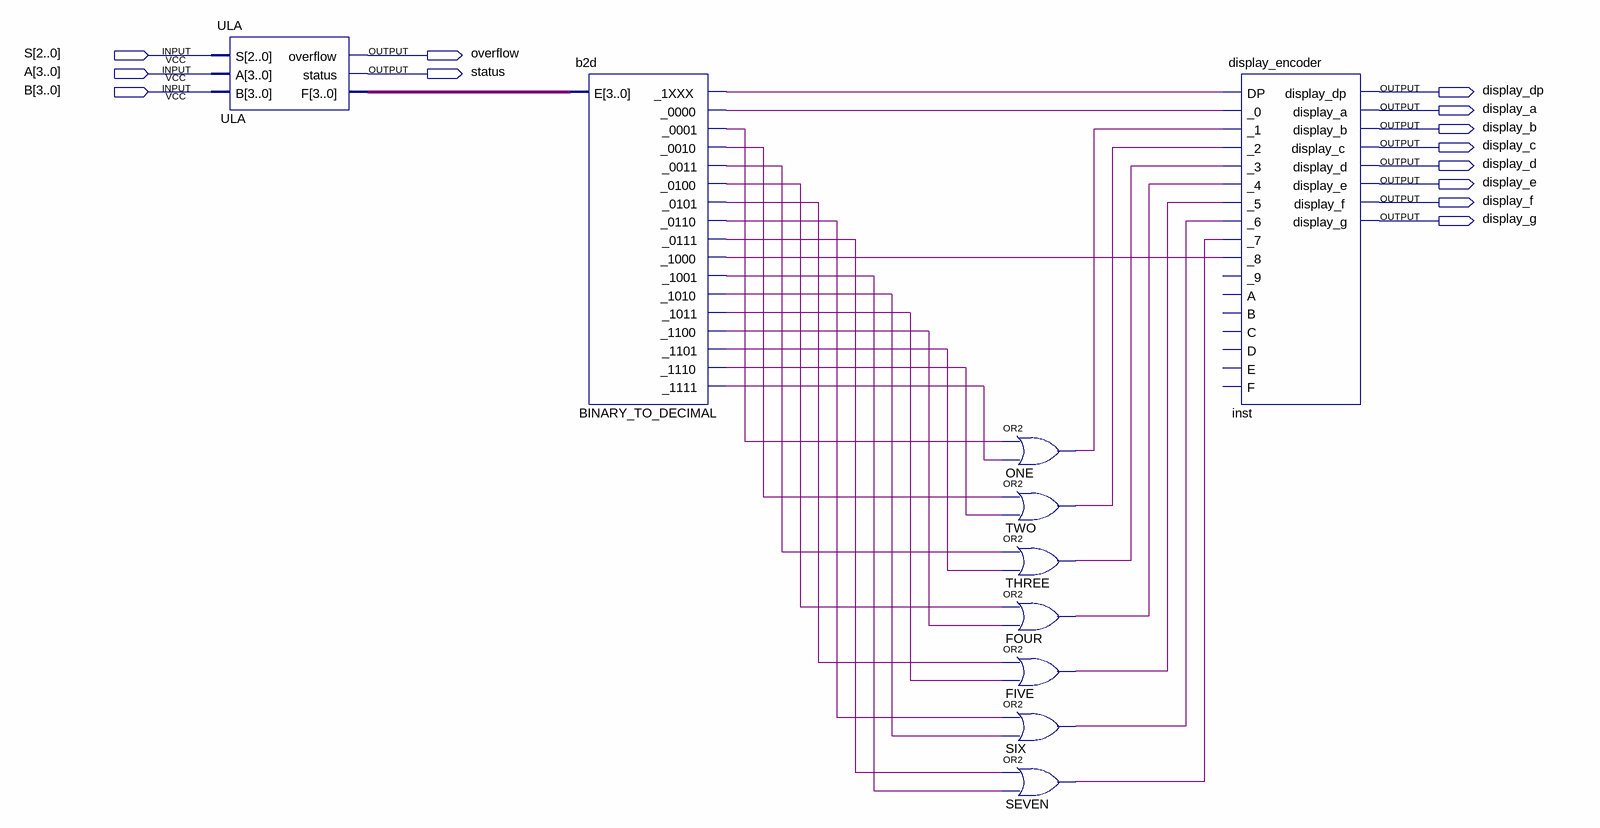
[diagram p0: schematic sheet]
// Quartus schematic placa_ULA.bdf as structural Verilog: 10 symbols, 13 pins
module placa_ULA (
  input  [2:0] S,
  input  [3:0] A,
  input  [3:0] B,
  output overflow,
  output status,
  output display_dp,
  output display_a,
  output display_b,
  output display_c,
  output display_d,
  output display_e,
  output display_f,
  output display_g
);

  wire BINARY_TO_DECIMAL__0000, BINARY_TO_DECIMAL__0001, BINARY_TO_DECIMAL__1xxx, BINARY_TO_DECIMAL__0010,
       BINARY_TO_DECIMAL__0011, BINARY_TO_DECIMAL__0100, BINARY_TO_DECIMAL__0101, BINARY_TO_DECIMAL__0110,
       BINARY_TO_DECIMAL__0111, BINARY_TO_DECIMAL__1000, BINARY_TO_DECIMAL__1001, BINARY_TO_DECIMAL__1010,
       BINARY_TO_DECIMAL__1011, BINARY_TO_DECIMAL__1100, BINARY_TO_DECIMAL__1101, BINARY_TO_DECIMAL__1110,
       BINARY_TO_DECIMAL__1111, FIVE_out, FOUR_out, ONE_out, SEVEN_out, SIX_out, THREE_out, TWO_out;
  wire [3:0] ULA_f;

  ULA ULA (.S(S), .A(A), .B(B), .overflow(overflow), .status(status), .F(ULA_f));
  b2d BINARY_TO_DECIMAL (
    .E(ULA_f), ._1XXX(BINARY_TO_DECIMAL__1xxx), ._0000(BINARY_TO_DECIMAL__0000),
    ._0001(BINARY_TO_DECIMAL__0001), ._0010(BINARY_TO_DECIMAL__0010), ._0011(BINARY_TO_DECIMAL__0011),
    ._0100(BINARY_TO_DECIMAL__0100), ._0101(BINARY_TO_DECIMAL__0101), ._0110(BINARY_TO_DECIMAL__0110),
    ._0111(BINARY_TO_DECIMAL__0111), ._1000(BINARY_TO_DECIMAL__1000), ._1001(BINARY_TO_DECIMAL__1001),
    ._1010(BINARY_TO_DECIMAL__1010), ._1011(BINARY_TO_DECIMAL__1011), ._1100(BINARY_TO_DECIMAL__1100),
    ._1101(BINARY_TO_DECIMAL__1101), ._1110(BINARY_TO_DECIMAL__1110), ._1111(BINARY_TO_DECIMAL__1111));
  or ONE (ONE_out, BINARY_TO_DECIMAL__0001, BINARY_TO_DECIMAL__1111);
  or TWO (TWO_out, BINARY_TO_DECIMAL__0010, BINARY_TO_DECIMAL__1110);
  or THREE (THREE_out, BINARY_TO_DECIMAL__0011, BINARY_TO_DECIMAL__1101);
  or FOUR (FOUR_out, BINARY_TO_DECIMAL__0100, BINARY_TO_DECIMAL__1100);
  or FIVE (FIVE_out, BINARY_TO_DECIMAL__0101, BINARY_TO_DECIMAL__1011);
  or SIX (SIX_out, BINARY_TO_DECIMAL__0110, BINARY_TO_DECIMAL__1010);
  or SEVEN (SEVEN_out, BINARY_TO_DECIMAL__0111, BINARY_TO_DECIMAL__1001);
  display_encoder inst (
    .DP(BINARY_TO_DECIMAL__1xxx), ._0(BINARY_TO_DECIMAL__0000), ._1(ONE_out), ._2(TWO_out), ._3(THREE_out),
    ._4(FOUR_out), ._5(FIVE_out), ._6(SIX_out), ._7(SEVEN_out), ._8(BINARY_TO_DECIMAL__1000),
    .display_dp(display_dp), .display_a(display_a), .display_b(display_b), .display_c(display_c),
    .display_d(display_d), .display_e(display_e), .display_f(display_f), .display_g(display_g));  // open: _9, A, B, C, D, E, F
endmodule
